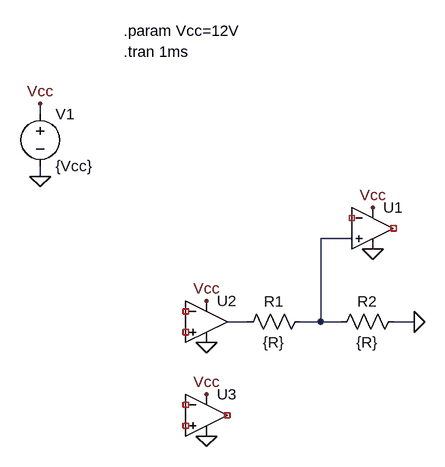
[diagram p0: schematic Draft2.asc]
Draft2.asc, the LTspice schematic file:
Version 4
SHEET 1 880 680
WIRE 64 160 64 144
WIRE 64 256 64 240
WIRE 544 352 496 352
WIRE 384 480 352 480
WIRE 496 480 496 352
WIRE 496 480 464 480
WIRE 528 480 496 480
WIRE 640 480 608 480
FLAG 576 368 0
FLAG 576 304 Vcc
FLAG 64 144 Vcc
FLAG 64 256 0
FLAG 320 512 0
FLAG 320 448 Vcc
FLAG 640 480 0
FLAG 320 656 0
FLAG 320 592 Vcc
SYMBOL OpAmps\\UniversalOpAmp2 576 336 R0
SYMATTR InstName U1
SYMBOL voltage 64 144 R0
WINDOW 123 0 0 Left 0
WINDOW 39 0 0 Left 0
SYMATTR InstName V1
SYMATTR Value {Vcc}
SYMBOL OpAmps\\UniversalOpAmp2 320 480 R0
SYMATTR InstName U2
SYMBOL res 480 464 R90
WINDOW 0 0 56 VBottom 2
WINDOW 3 32 56 VTop 2
SYMATTR InstName R1
SYMATTR Value {R}
SYMBOL res 624 464 R90
WINDOW 0 0 56 VBottom 2
WINDOW 3 32 56 VTop 2
SYMATTR InstName R2
SYMATTR Value {R}
SYMBOL OpAmps\\UniversalOpAmp2 320 624 R0
SYMATTR InstName U3
TEXT 192 64 Left 2 !.tran 1ms
TEXT 192 32 Left 2 !.param Vcc=12V

The netlist it stands for:
* Draft2.asc
XU1 N001 NC_01 Vcc 0 NC_02 level2 Avol=1Meg GBW=10Meg Slew=10Meg Ilimit=25m Rail=0 Vos=0 En=0 Enk=0 In=0 Ink=0 Rin=500Meg  ; pins In+ In- V+ V- OUT
V1 Vcc 0 {Vcc}
XU2 NC_03 NC_04 Vcc 0 N002 level2 Avol=1Meg GBW=10Meg Slew=10Meg Ilimit=25m Rail=0 Vos=0 En=0 Enk=0 In=0 Ink=0 Rin=500Meg  ; pins In+ In- V+ V- OUT
R1 N001 N002 {R}
R2 0 N001 {R}
XU3 NC_05 NC_06 Vcc 0 NC_07 level2 Avol=1Meg GBW=10Meg Slew=10Meg Ilimit=25m Rail=0 Vos=0 En=0 Enk=0 In=0 Ink=0 Rin=500Meg  ; pins In+ In- V+ V- OUT
.tran 1ms
.param Vcc=12V
.lib UniversalOpAmp2.lib
.backanno
.end